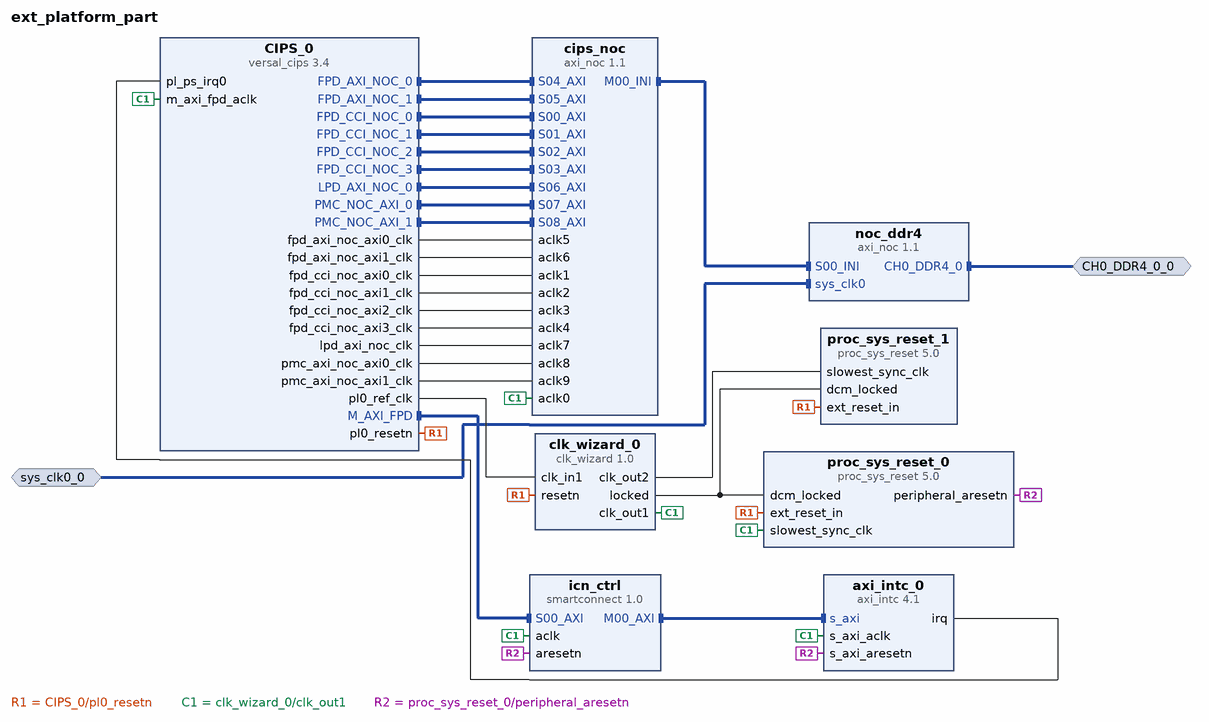
[diagram p0: block diagram of the top level]
# Vivado block design ext_platform_part, xcvp1552-vsva3340-2MHP-e-S, Vivado 2025.2
create_bd_design ext_platform_part

create_bd_intf_port -mode Slave -vlnv xilinx.com:interface:diff_clock_rtl:1.0 sys_clk0_0
set_property -dict {CONFIG.FREQ_HZ 200000000} [get_bd_intf_ports sys_clk0_0]
create_bd_intf_port -mode Master -vlnv xilinx.com:interface:ddr4_rtl:1.0 CH0_DDR4_0_0

create_bd_cell -type ip -vlnv xilinx.com:ip:versal_cips:3.4 CIPS_0
set_property -dict [list \
  CONFIG.BOOT_MODE Custom \
  CONFIG.CLOCK_MODE Custom \
  CONFIG.DDR_MEMORY_MODE Custom \
  CONFIG.DESIGN_MODE 1 \
  CONFIG.IO_CONFIG_MODE Custom \
  CONFIG.PS_PL_CONNECTIVITY_MODE Custom \
  CONFIG.PS_PMC_CONFIG {['BOOT_MODE Custom', 'CLOCK_MODE Custom', 'DDR_MEMORY_MODE Custom', 'DESIGN_MODE 1', 'IO_CONFIG_MODE Custom', 'PMC_CRP_PL0_REF_CTRL_FREQMHZ 99.999992', 'PMC_QSPI_FBCLK {{ENABLE 1} {IO {PMC_MIO 6}}}', 'PMC_QSPI_PERIPHERAL_ENABLE 0', 'PMC_SD0 {{CD_ENABLE 0} {CD_IO {PMC_MIO 24}} {POW_ENABLE 0} {POW_IO {PMC_MIO 17}} {RESET_ENABLE 0} {RESET_IO {PMC_MIO 17}} {WP_ENABLE 0} {WP_IO {PMC_MIO 25}}}', 'PMC_SD0_PERIPHERAL {{CLK_100_SDR_OTAP_DLY 0x00} {CLK_200_SDR_OTAP_DLY 0x00} {CLK_50_DDR_ITAP_DLY 0x00} {CLK_50_DDR_OTAP_DLY 0x00} {CLK_50_SDR_ITAP_DLY 0x00} {CLK_50_SDR_OTAP_DLY 0x00} {ENABLE 0} {IO {PMC_MIO 13 .. 25}}}', 'PMC_SD0_SLOT_TYPE {SD 2.0}', 'PMC_SD1_PERIPHERAL {{CLK_100_SDR_OTAP_DLY 0x3} {CLK_200_SDR_OTAP_DLY 0x2} {CLK_50_DDR_ITAP_DLY 0x36} {CLK_50_DDR_OTAP_DLY 0x3} {CLK_50_SDR_ITAP_DLY 0x2C} {CLK_50_SDR_OTAP_DLY 0x4} {ENABLE 1} {IO {PMC_MIO 26 .. 36}}}', 'PMC_SD1_SLOT_TYPE {SD 3.0}', 'PMC_SMAP_PERIPHERAL {{ENABLE 0} {IO {32 Bit}}}', 'PMC_USE_PMC_NOC_AXI0 1', 'PMC_USE_PMC_NOC_AXI1 1', 'PS_BOARD_INTERFACE Custom', 'PS_ENET0_MDIO {{ENABLE 1} {IO {PS_MIO 24 .. 25}}}', 'PS_ENET0_PERIPHERAL {{ENABLE 1} {IO {PS_MIO 0 .. 11}}}', 'PS_GEN_IPI0_ENABLE 1', 'PS_GEN_IPI0_MASTER A72', 'PS_GEN_IPI1_ENABLE 1', 'PS_GEN_IPI1_MASTER A72', 'PS_GEN_IPI2_ENABLE 1', 'PS_GEN_IPI2_MASTER A72', 'PS_GEN_IPI3_ENABLE 1', 'PS_GEN_IPI3_MASTER A72', 'PS_GEN_IPI4_ENABLE 1', 'PS_GEN_IPI4_MASTER A72', 'PS_GEN_IPI5_ENABLE 1', 'PS_GEN_IPI5_MASTER A72', 'PS_GEN_IPI6_ENABLE 1', 'PS_GEN_IPI6_MASTER A72', 'PS_IRQ_USAGE {{CH0 1} {CH1 0} {CH10 0} {CH11 0} {CH12 0} {CH13 0} {CH14 0} {CH15 0} {CH2 0} {CH3 0} {CH4 0} {CH5 0} {CH6 0} {CH7 0} {CH8 0} {CH9 0}}', 'PS_NUM_FABRIC_RESETS 1', 'PS_PL_CONNECTIVITY_MODE Custom', 'PS_TTC0_PERIPHERAL_ENABLE 1', 'PS_UART0_PERIPHERAL {{ENABLE 1} {IO {PMC_MIO 42 .. 43}}}', 'PS_USE_FPD_AXI_NOC0 1', 'PS_USE_FPD_AXI_NOC1 1', 'PS_USE_FPD_CCI_NOC 1', 'PS_USE_M_AXI_FPD 1', 'PS_USE_NOC_LPD_AXI0 1', 'PS_USE_PMCPL_CLK0 1', 'PS_USE_PMCPL_CLK1 0', 'PS_USE_PMCPL_CLK2 0', 'PS_USE_PMCPL_CLK3 0', 'SLR1_PMC_CRP_HSM0_REF_CTRL_FREQMHZ 100', 'SMON_ALARMS Set_Alarms_On', 'SMON_ENABLE_TEMP_AVERAGING 0', 'SMON_TEMP_AVERAGING_SAMPLES 0']} \
  CONFIG.PS_PMC_CONFIG_APPLIED 1 \
] [get_bd_cells CIPS_0]
create_bd_cell -type ip -vlnv xilinx.com:ip:axi_intc:4.1 axi_intc_0
set_property -dict {CONFIG.C_ASYNC_INTR 0xFFFFFFFF CONFIG.C_IRQ_CONNECTION 1} [get_bd_cells axi_intc_0]
create_bd_cell -type ip -vlnv xilinx.com:ip:clk_wizard:1.0 clk_wizard_0
set_property -dict [list \
  CONFIG.CLKOUT_DRIVES BUFG,BUFG,BUFG,BUFG,BUFG,BUFG,BUFG \
  CONFIG.CLKOUT_DYN_PS None,None,None,None,None,None,None \
  CONFIG.CLKOUT_MATCHED_ROUTING false,false,false,false,false,false,false \
  CONFIG.CLKOUT_PORT clk_out1,clk_out2,clk_out3,clk_out4,clk_out5,clk_out6,clk_out7 \
  CONFIG.CLKOUT_REQUESTED_DUTY_CYCLE 50.000,50.000,50.000,50.000,50.000,50.000,50.000 \
  CONFIG.CLKOUT_REQUESTED_OUT_FREQUENCY 200.000,200.000,312.500000,100.000,100.000,100.000,100.000 \
  CONFIG.CLKOUT_REQUESTED_PHASE 0.000,0.000,0.000,0.000,0.000,0.000,0.000 \
  CONFIG.CLKOUT_USED true,true,false,false,false,false,false \
  CONFIG.JITTER_SEL Min_O_Jitter \
  CONFIG.PRIM_SOURCE No_buffer \
  CONFIG.RESET_TYPE ACTIVE_LOW \
  CONFIG.USE_LOCKED true \
  CONFIG.USE_PHASE_ALIGNMENT true \
  CONFIG.USE_RESET true \
] [get_bd_cells clk_wizard_0]
create_bd_cell -type ip -vlnv xilinx.com:ip:axi_noc:1.1 cips_noc
set_property -dict {CONFIG.NUM_CLKS 10 CONFIG.NUM_MI 0 CONFIG.NUM_NMI 2 CONFIG.NUM_NSI 0 CONFIG.NUM_SI 9} [get_bd_cells cips_noc]
create_bd_cell -type ip -vlnv xilinx.com:ip:axi_noc:1.1 noc_ddr4
set_property -dict [list \
  CONFIG.MC0_CONFIG_NUM config14 \
  CONFIG.MC_CHAN_REGION1 DDR_LOW1 \
  CONFIG.MC_DATAWIDTH 72 \
  CONFIG.MC_EN_INTR_RESP TRUE \
  CONFIG.MC_INPUTCLK0_PERIOD 5000 \
  CONFIG.MC_MEMORY_DEVICETYPE UDIMMs \
  CONFIG.MC_MEMORY_SPEEDGRADE {DDR4-2666V(19-19-19)} \
  CONFIG.MC_MEMORY_TIMEPERIOD0 800 \
  CONFIG.MC_ROWADDRESSWIDTH 17 \
  CONFIG.NUM_CLKS 0 \
  CONFIG.NUM_MC 1 \
  CONFIG.NUM_MCP 4 \
  CONFIG.NUM_MI 0 \
  CONFIG.NUM_NSI 1 \
  CONFIG.NUM_SI 0 \
] [get_bd_cells noc_ddr4]
create_bd_cell -type ip -vlnv xilinx.com:ip:proc_sys_reset:5.0 proc_sys_reset_0
create_bd_cell -type ip -vlnv xilinx.com:ip:proc_sys_reset:5.0 proc_sys_reset_1
create_bd_cell -type ip -vlnv xilinx.com:ip:smartconnect:1.0 icn_ctrl
set_property -dict {CONFIG.NUM_CLKS 1 CONFIG.NUM_MI 1 CONFIG.NUM_SI 1} [get_bd_cells icn_ctrl]

# ---- connections ----

connect_bd_intf_net [get_bd_intf_pins CIPS_0/FPD_AXI_NOC_0] [get_bd_intf_pins cips_noc/S04_AXI]
connect_bd_intf_net [get_bd_intf_pins CIPS_0/FPD_AXI_NOC_1] [get_bd_intf_pins cips_noc/S05_AXI]
connect_bd_intf_net [get_bd_intf_pins CIPS_0/FPD_CCI_NOC_0] [get_bd_intf_pins cips_noc/S00_AXI]
connect_bd_intf_net [get_bd_intf_pins CIPS_0/FPD_CCI_NOC_1] [get_bd_intf_pins cips_noc/S01_AXI]
connect_bd_intf_net [get_bd_intf_pins CIPS_0/FPD_CCI_NOC_2] [get_bd_intf_pins cips_noc/S02_AXI]
connect_bd_intf_net [get_bd_intf_pins CIPS_0/FPD_CCI_NOC_3] [get_bd_intf_pins cips_noc/S03_AXI]
connect_bd_intf_net [get_bd_intf_pins CIPS_0/LPD_AXI_NOC_0] [get_bd_intf_pins cips_noc/S06_AXI]
connect_bd_intf_net -intf_net CIPS_0_M_AXI_GP0 [get_bd_intf_pins CIPS_0/M_AXI_FPD] [get_bd_intf_pins icn_ctrl/S00_AXI]
connect_bd_intf_net [get_bd_intf_pins CIPS_0/PMC_NOC_AXI_0] [get_bd_intf_pins cips_noc/S07_AXI]
connect_bd_intf_net [get_bd_intf_pins CIPS_0/PMC_NOC_AXI_1] [get_bd_intf_pins cips_noc/S08_AXI]
connect_bd_intf_net [get_bd_intf_pins cips_noc/M00_INI] [get_bd_intf_pins noc_ddr4/S00_INI]
connect_bd_intf_net [get_bd_intf_pins axi_intc_0/s_axi] [get_bd_intf_pins icn_ctrl/M00_AXI]
connect_bd_intf_net [get_bd_intf_ports CH0_DDR4_0_0] [get_bd_intf_pins noc_ddr4/CH0_DDR4_0]
connect_bd_intf_net -intf_net sys_clk0_0_1 [get_bd_intf_ports sys_clk0_0] [get_bd_intf_pins noc_ddr4/sys_clk0]
connect_bd_net [get_bd_pins CIPS_0/fpd_axi_noc_axi0_clk] [get_bd_pins cips_noc/aclk5]
connect_bd_net [get_bd_pins CIPS_0/fpd_axi_noc_axi1_clk] [get_bd_pins cips_noc/aclk6]
connect_bd_net [get_bd_pins CIPS_0/fpd_cci_noc_axi0_clk] [get_bd_pins cips_noc/aclk1]
connect_bd_net [get_bd_pins CIPS_0/fpd_cci_noc_axi1_clk] [get_bd_pins cips_noc/aclk2]
connect_bd_net [get_bd_pins CIPS_0/fpd_cci_noc_axi2_clk] [get_bd_pins cips_noc/aclk3]
connect_bd_net [get_bd_pins CIPS_0/fpd_cci_noc_axi3_clk] [get_bd_pins cips_noc/aclk4]
connect_bd_net [get_bd_pins CIPS_0/lpd_axi_noc_clk] [get_bd_pins cips_noc/aclk7]
connect_bd_net -net CIPS_0_pl_clk0 [get_bd_pins CIPS_0/pl0_ref_clk] [get_bd_pins clk_wizard_0/clk_in1]
connect_bd_net -net CIPS_0_pl_resetn1 [get_bd_pins CIPS_0/pl0_resetn] \
  [get_bd_pins clk_wizard_0/resetn] [get_bd_pins proc_sys_reset_0/ext_reset_in] [get_bd_pins proc_sys_reset_1/ext_reset_in]
connect_bd_net [get_bd_pins CIPS_0/pmc_axi_noc_axi0_clk] [get_bd_pins cips_noc/aclk8]
connect_bd_net [get_bd_pins CIPS_0/pmc_axi_noc_axi1_clk] [get_bd_pins cips_noc/aclk9]
connect_bd_net [get_bd_pins axi_intc_0/irq] [get_bd_pins CIPS_0/pl_ps_irq0]
connect_bd_net [get_bd_pins clk_wizard_0/clk_out1] \
  [get_bd_pins icn_ctrl/aclk] [get_bd_pins proc_sys_reset_0/slowest_sync_clk] [get_bd_pins axi_intc_0/s_axi_aclk] \
  [get_bd_pins CIPS_0/m_axi_fpd_aclk] [get_bd_pins cips_noc/aclk0]
connect_bd_net [get_bd_pins clk_wizard_0/clk_out2] [get_bd_pins proc_sys_reset_1/slowest_sync_clk]
connect_bd_net [get_bd_pins clk_wizard_0/locked] [get_bd_pins proc_sys_reset_0/dcm_locked] [get_bd_pins proc_sys_reset_1/dcm_locked]
connect_bd_net [get_bd_pins proc_sys_reset_0/peripheral_aresetn] [get_bd_pins icn_ctrl/aresetn] [get_bd_pins axi_intc_0/s_axi_aresetn]
set_property PFM.IRQ {intr {id 0 range 15}} [get_bd_cells axi_intc_0]
set_property PFM.CLOCK {clk_out1 {id "0" is_default "true" proc_sys_reset "/proc_sys_reset_0" status "fixed"} clk_out2 {id "1" is_default "false" proc_sys_reset "/proc_sys_reset_1" status "fixed"}} [get_bd_cells clk_wizard_0]
set_property PFM.AXI_PORT {S00_AXI {memport "S_AXI_NOC" sptag "DDR"} S01_AXI {memport "S_AXI_NOC" sptag "DDR"} S02_AXI {memport "S_AXI_NOC" sptag "DDR"} S03_AXI {memport "S_AXI_NOC" sptag "DDR"} S04_AXI {memport "S_AXI_NOC" sptag "DDR"} S05_AXI {memport "S_AXI_NOC" sptag "DDR"} S06_AXI {memport "S_AXI_NOC" sptag "DDR"} S07_AXI {memport "S_AXI_NOC" sptag "DDR"} S08_AXI {memport "S_AXI_NOC" sptag "DDR"} S09_AXI {memport "S_AXI_NOC" sptag "DDR"} S10_AXI {memport "S_AXI_NOC" sptag "DDR"} S11_AXI {memport "S_AXI_NOC" sptag "DDR"} S12_AXI {memport "S_AXI_NOC" sptag "DDR"} S13_AXI {memport "S_AXI_NOC" sptag "DDR"} S14_AXI {memport "S_AXI_NOC" sptag "DDR"} S15_AXI {memport "S_AXI_NOC" sptag "DDR"} S16_AXI {memport "S_AXI_NOC" sptag "DDR"} S17_AXI {memport "S_AXI_NOC" sptag "DDR"} S18_AXI {memport "S_AXI_NOC" sptag "DDR"} S19_AXI {memport "S_AXI_NOC" sptag "DDR"} S20_AXI {memport "S_AXI_NOC" sptag "DDR"} S21_AXI {memport "S_AXI_NOC" sptag "DDR"} S22_AXI {memport "S_AXI_NOC" sptag "DDR"} S23_AXI {memport "S_AXI_NOC" sptag "DDR"} S24_AXI {memport "S_AXI_NOC" sptag "DDR"} S25_AXI {memport "S_AXI_NOC" sptag "DDR"} S26_AXI {memport "S_AXI_NOC" sptag "DDR"} S27_AXI {memport "S_AXI_NOC" sptag "DDR"} S28_AXI {memport "S_AXI_NOC" sptag "DDR"} S29_AXI {memport "S_AXI_NOC" sptag "DDR"} S30_AXI {memport "S_AXI_NOC" sptag "DDR"} S31_AXI {memport "S_AXI_NOC" sptag "DDR"} S32_AXI {memport "S_AXI_NOC" sptag "DDR"} S33_AXI {memport "S_AXI_NOC" sptag "DDR"} S34_AXI {memport "S_AXI_NOC" sptag "DDR"} S35_AXI {memport "S_AXI_NOC" sptag "DDR"} S36_AXI {memport "S_AXI_NOC" sptag "DDR"} S37_AXI {memport "S_AXI_NOC" sptag "DDR"} S38_AXI {memport "S_AXI_NOC" sptag "DDR"} S39_AXI {memport "S_AXI_NOC" sptag "DDR"} S40_AXI {memport "S_AXI_NOC" sptag "DDR"} S41_AXI {memport "S_AXI_NOC" sptag "DDR"} S42_AXI {memport "S_AXI_NOC" sptag "DDR"} S43_AXI {memport "S_AXI_NOC" sptag "DDR"} S44_AXI {memport "S_AXI_NOC" sptag "DDR"} S45_AXI {memport "S_AXI_NOC" sptag "DDR"} S46_AXI {memport "S_AXI_NOC" sptag "DDR"} S47_AXI {memport "S_AXI_NOC" sptag "DDR"} S48_AXI {memport "S_AXI_NOC" sptag "DDR"} S49_AXI {memport "S_AXI_NOC" sptag "DDR"} S50_AXI {memport "S_AXI_NOC" sptag "DDR"} S51_AXI {memport "S_AXI_NOC" sptag "DDR"} } [get_bd_cells noc_ddr4]
set_property PFM.AXI_PORT {M01_AXI {memport "M_AXI_GP" sptag "" memory ""} M02_AXI {memport "M_AXI_GP" sptag "" memory ""} M03_AXI {memport "M_AXI_GP" sptag "" memory ""} M04_AXI {memport "M_AXI_GP" sptag "" memory ""} M05_AXI {memport "M_AXI_GP" sptag "" memory ""} M06_AXI {memport "M_AXI_GP" sptag "" memory ""} M07_AXI {memport "M_AXI_GP" sptag "" memory ""} M08_AXI {memport "M_AXI_GP" sptag "" memory ""} M09_AXI {memport "M_AXI_GP" sptag "" memory ""} M10_AXI {memport "M_AXI_GP" sptag "" memory ""} M11_AXI {memport "M_AXI_GP" sptag "" memory ""} M12_AXI {memport "M_AXI_GP" sptag "" memory ""} M13_AXI {memport "M_AXI_GP" sptag "" memory ""} M14_AXI {memport "M_AXI_GP" sptag "" memory ""} M15_AXI {memport "M_AXI_GP" sptag "" memory ""}} [get_bd_cells icn_ctrl]

# ---- address map ----
assign_bd_address -offset 0x0000000000000000 -range 2G -target_address_space [get_bd_addr_spaces CIPS_0/FPD_AXI_NOC_0] [get_bd_addr_segs noc_ddr4/S00_INI/C0_DDR_LOW0]
assign_bd_address -offset 0x0000000800000000 -range 6G -target_address_space [get_bd_addr_spaces CIPS_0/FPD_AXI_NOC_0] [get_bd_addr_segs noc_ddr4/S00_INI/C0_DDR_LOW1]
assign_bd_address -offset 0x0000000000000000 -range 2G -target_address_space [get_bd_addr_spaces CIPS_0/FPD_AXI_NOC_1] [get_bd_addr_segs noc_ddr4/S00_INI/C0_DDR_LOW0]
assign_bd_address -offset 0x0000000800000000 -range 6G -target_address_space [get_bd_addr_spaces CIPS_0/FPD_AXI_NOC_1] [get_bd_addr_segs noc_ddr4/S00_INI/C0_DDR_LOW1]
assign_bd_address -offset 0x0000000000000000 -range 2G -target_address_space [get_bd_addr_spaces CIPS_0/FPD_CCI_NOC_0] [get_bd_addr_segs noc_ddr4/S00_INI/C0_DDR_LOW0]
assign_bd_address -offset 0x0000000800000000 -range 6G -target_address_space [get_bd_addr_spaces CIPS_0/FPD_CCI_NOC_0] [get_bd_addr_segs noc_ddr4/S00_INI/C0_DDR_LOW1]
assign_bd_address -offset 0x0000000000000000 -range 2G -target_address_space [get_bd_addr_spaces CIPS_0/FPD_CCI_NOC_1] [get_bd_addr_segs noc_ddr4/S00_INI/C0_DDR_LOW0]
assign_bd_address -offset 0x0000000800000000 -range 6G -target_address_space [get_bd_addr_spaces CIPS_0/FPD_CCI_NOC_1] [get_bd_addr_segs noc_ddr4/S00_INI/C0_DDR_LOW1]
assign_bd_address -offset 0x0000000000000000 -range 2G -target_address_space [get_bd_addr_spaces CIPS_0/FPD_CCI_NOC_2] [get_bd_addr_segs noc_ddr4/S00_INI/C0_DDR_LOW0]
assign_bd_address -offset 0x0000000800000000 -range 6G -target_address_space [get_bd_addr_spaces CIPS_0/FPD_CCI_NOC_2] [get_bd_addr_segs noc_ddr4/S00_INI/C0_DDR_LOW1]
assign_bd_address -offset 0x0000000000000000 -range 2G -target_address_space [get_bd_addr_spaces CIPS_0/FPD_CCI_NOC_3] [get_bd_addr_segs noc_ddr4/S00_INI/C0_DDR_LOW0]
assign_bd_address -offset 0x0000000800000000 -range 6G -target_address_space [get_bd_addr_spaces CIPS_0/FPD_CCI_NOC_3] [get_bd_addr_segs noc_ddr4/S00_INI/C0_DDR_LOW1]
assign_bd_address -offset 0x0000000000000000 -range 2G -target_address_space [get_bd_addr_spaces CIPS_0/LPD_AXI_NOC_0] [get_bd_addr_segs noc_ddr4/S00_INI/C0_DDR_LOW0]
assign_bd_address -offset 0x0000000800000000 -range 6G -target_address_space [get_bd_addr_spaces CIPS_0/LPD_AXI_NOC_0] [get_bd_addr_segs noc_ddr4/S00_INI/C0_DDR_LOW1]
assign_bd_address -offset 0x000A4000000 -range 64K -target_address_space [get_bd_addr_spaces CIPS_0/M_AXI_FPD] [get_bd_addr_segs axi_intc_0/S_AXI/Reg]
assign_bd_address -offset 0x0000000000000000 -range 2G -target_address_space [get_bd_addr_spaces CIPS_0/PMC_NOC_AXI_0] [get_bd_addr_segs noc_ddr4/S00_INI/C0_DDR_LOW0]
assign_bd_address -offset 0x0000000800000000 -range 6G -target_address_space [get_bd_addr_spaces CIPS_0/PMC_NOC_AXI_0] [get_bd_addr_segs noc_ddr4/S00_INI/C0_DDR_LOW1]
assign_bd_address -offset 0x0000000000000000 -range 2G -target_address_space [get_bd_addr_spaces CIPS_0/PMC_NOC_AXI_1] [get_bd_addr_segs noc_ddr4/S00_INI/C0_DDR_LOW0]
assign_bd_address -offset 0x0000000800000000 -range 6G -target_address_space [get_bd_addr_spaces CIPS_0/PMC_NOC_AXI_1] [get_bd_addr_segs noc_ddr4/S00_INI/C0_DDR_LOW1]

set_property USER_COMMENTS.comment0 "\\t \\t \\t =============== >>>> An Example Versal Extensible Embedded Platform <<<< ===============\n	\\t Note: \n	\\t --> SD boot mode and UART are enabled in the CIPS / PS Wizard\n	\\t --> Execute TCL command: launch_simulation -scripts_only ,to establish the sim_1 source set hierarchy after successful design creation" [current_bd_design]

validate_bd_design
save_bd_design
